# Altium schematic sheet sampler.SchDoc
size Letter
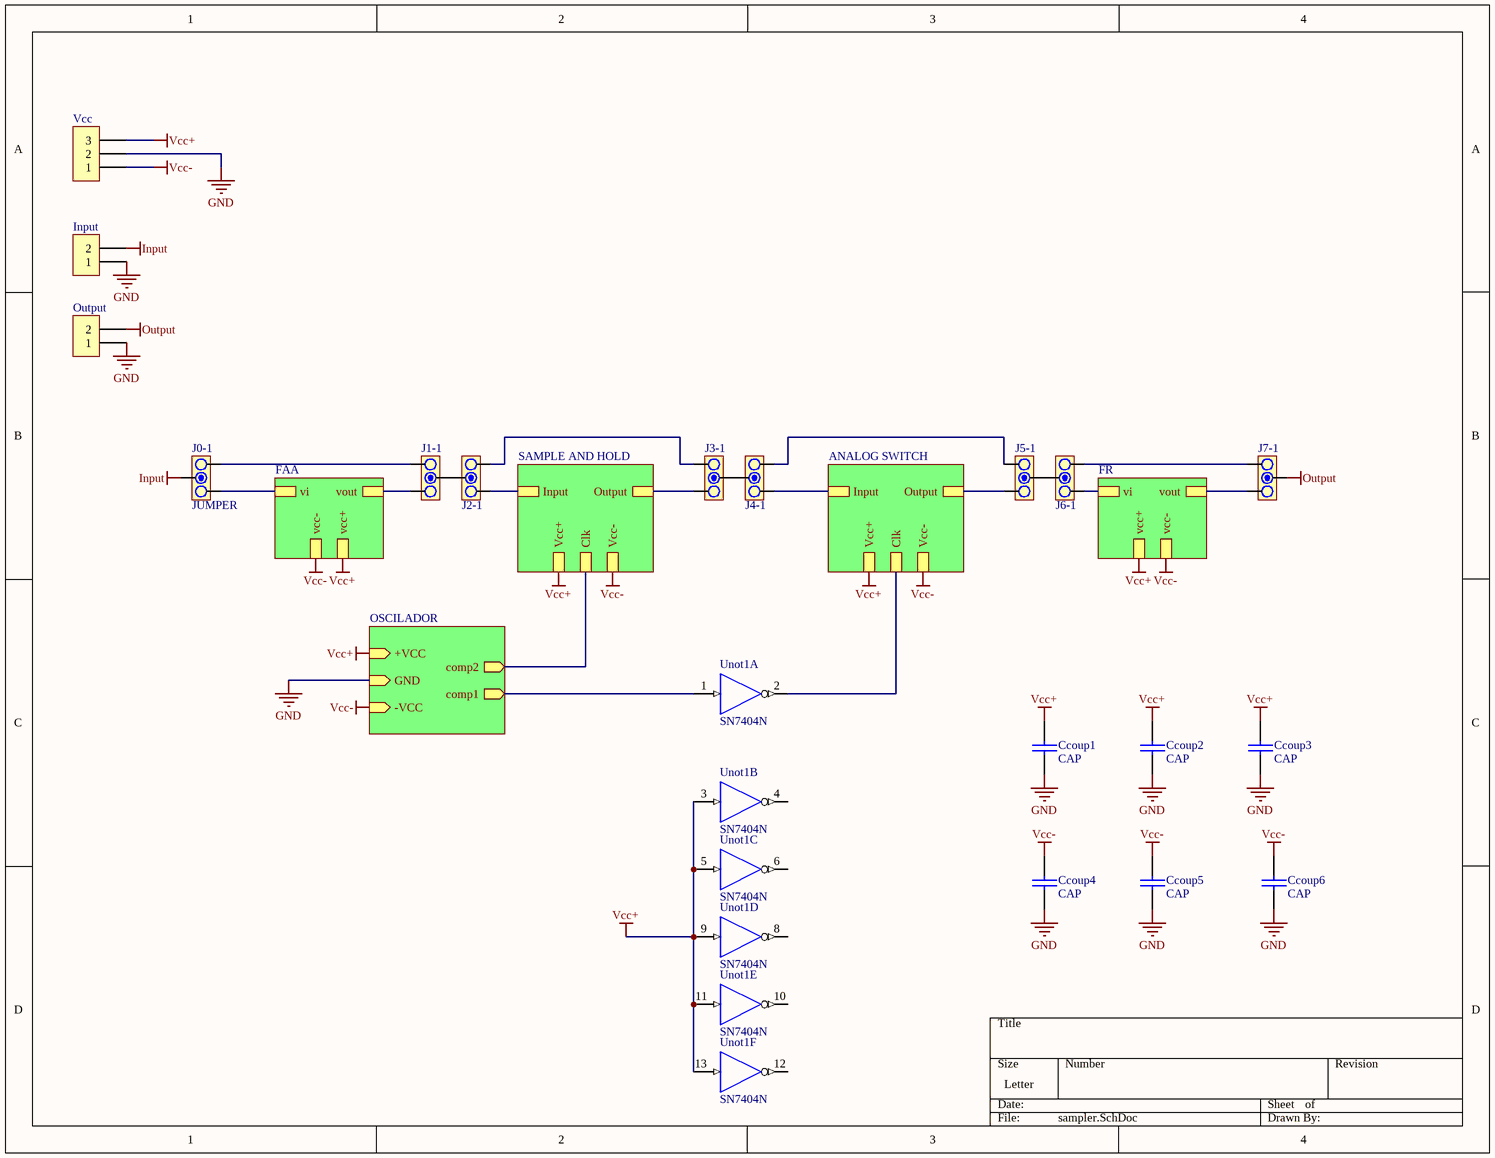
[diagram p0: sampler.SchDoc]

## Parts
Ccoup1  CAP  [CAP200]
Ccoup2  CAP  [CAP200]
Ccoup3  CAP  [CAP200]
Ccoup4  CAP  [CAP200]
Ccoup5  CAP  [CAP200]
Ccoup6  CAP  [CAP200]
Input  BORNERA 2  [BORNERA2]  (value not drawn)
J0-1  JUMPER  [JUMPER3]
J1-1  JUMPER  [JUMPER3]  (value not drawn)
J2-1  JUMPER  [JUMPER3]  (value not drawn)
J3-1  JUMPER  [JUMPER3]  (value not drawn)
J4-1  JUMPER  [JUMPER3]  (value not drawn)
J5-1  JUMPER  [JUMPER3]  (value not drawn)
J6-1  JUMPER  [JUMPER3]  (value not drawn)
J7-1  JUMPER  [JUMPER3]  (value not drawn)
Output  BORNERA 2  [BORNERA2]  (value not drawn)
Unot1  SN7404N  [N014]  (parts A,B,C,D,E,F of 6)
Vcc  BORNERA 3  [BORNERA3]  (value not drawn)

## Sub-sheets
ANALOG SWITCH = analogSwitch.SchDoc: Input, Output, Vcc+, Vcc-, Clk
FAA = Schematic.SchDoc: vcc+, vcc-, vi, vout
FR = Schematic.SchDoc: vcc+, vcc-, vi, vout
OSCILADOR = placaOscilador_TP1_ASSD.SchDoc: +VCC (in), GND (in), -VCC (in), comp2 (out), comp1 (out)
SAMPLE AND HOLD = s&h.SchDoc: Output, Input, Vcc-, Vcc+, Clk

## Nets
GND: Ccoup1.2 Ccoup2.2 Ccoup3.2 Ccoup4.2 Ccoup5.2 Ccoup6.2 Input.1 Output.1 Unot1.7(GND) Vcc.2 ; sheet OSCILADOR/GND
Input: Input.2 J0-1.2
Output: J7-1.2 Output.2
VCC: Unot1.14(VCC)
Vcc+: Ccoup1.1 Ccoup2.1 Ccoup3.1 Unot1.3(A) Unot1.5(A) Unot1.9(A) Unot1.11(A) Unot1.13(A) Vcc.3 ; sheet SAMPLE AND HOLD/Vcc+, sheet OSCILADOR/+VCC, sheet FAA/vcc+, sheet FR/vcc+, sheet ANALOG SWITCH/Vcc+
Vcc-: Ccoup4.1 Ccoup5.1 Ccoup6.1 Vcc.1 ; sheet SAMPLE AND HOLD/Vcc-, sheet OSCILADOR/-VCC, sheet FAA/vcc-, sheet FR/vcc-, sheet ANALOG SWITCH/Vcc-
NetJ0-1_1: J0-1.1 J1-1.3
NetJ0-1_3: J0-1.3 ; sheet FAA/vi
NetJ1-1_1: J1-1.1 ; sheet FAA/vout
NetJ1-1_2: J1-1.2 J2-1.2
NetJ2-1_1: J2-1.1 J3-1.3
NetJ2-1_3: J2-1.3 ; sheet SAMPLE AND HOLD/Input
NetJ3-1_1: J3-1.1 ; sheet SAMPLE AND HOLD/Output
NetJ3-1_2: J3-1.2 J4-1.2
NetJ4-1_1: J4-1.1 J5-1.3
NetJ4-1_3: J4-1.3 ; sheet ANALOG SWITCH/Input
NetJ5-1_1: J5-1.1 ; sheet ANALOG SWITCH/Output
NetJ5-1_2: J5-1.2 J6-1.2
NetJ6-1_1: J6-1.1 J7-1.3
NetJ6-1_3: J6-1.3 ; sheet FR/vi
NetJ7-1_1: J7-1.1 ; sheet FR/vout
NetUnot1_1: Unot1.1(A) ; sheet OSCILADOR/comp1
NetUnot1_2: Unot1.2(Y) ; sheet ANALOG SWITCH/Clk
(unnamed): sheet SAMPLE AND HOLD/Clk, sheet OSCILADOR/comp2

Not connected (* = marked no-connect by the designer): Unot1 4(Y) 6(Y) 8(Y) 10(Y) 12(Y)

## Library data of the parts
J0-1 J1-1 J2-1 J3-1 J4-1 J5-1 J6-1 J7-1 = JUMPER3
Unot1 = SN7404N: Hex Inverter; Published: 8-Jun-2000; LatestRevisionDate: 04-Mar-2005; LatestRevisionNote: Stylized 3D Model Added.; DatasheetVersion: Mar-1988; PackageVersion: Oct-1995; PackageReference: N014; Publisher: Altium Limited; PackageDescription: DIP; 14 Leads; Row Spacing 7.62 mm; Pitch 2.54 mm; ComponentLink1Description: Manufacturer Link; ComponentLink1URL: http://www.ti.com/; ComponentLink2Description: Datasheet; ComponentLink2URL: http://www-s.ti.com/sc/ds/sn5404.pdf; ComponentLink3Description: Packaging Specification; ComponentLink3URL: http://focus.ti.com/lit/ml/mpdi002c/mpdi002c.pdf